# EAGLE design AIRDCR (EAGLE 9.5.1)
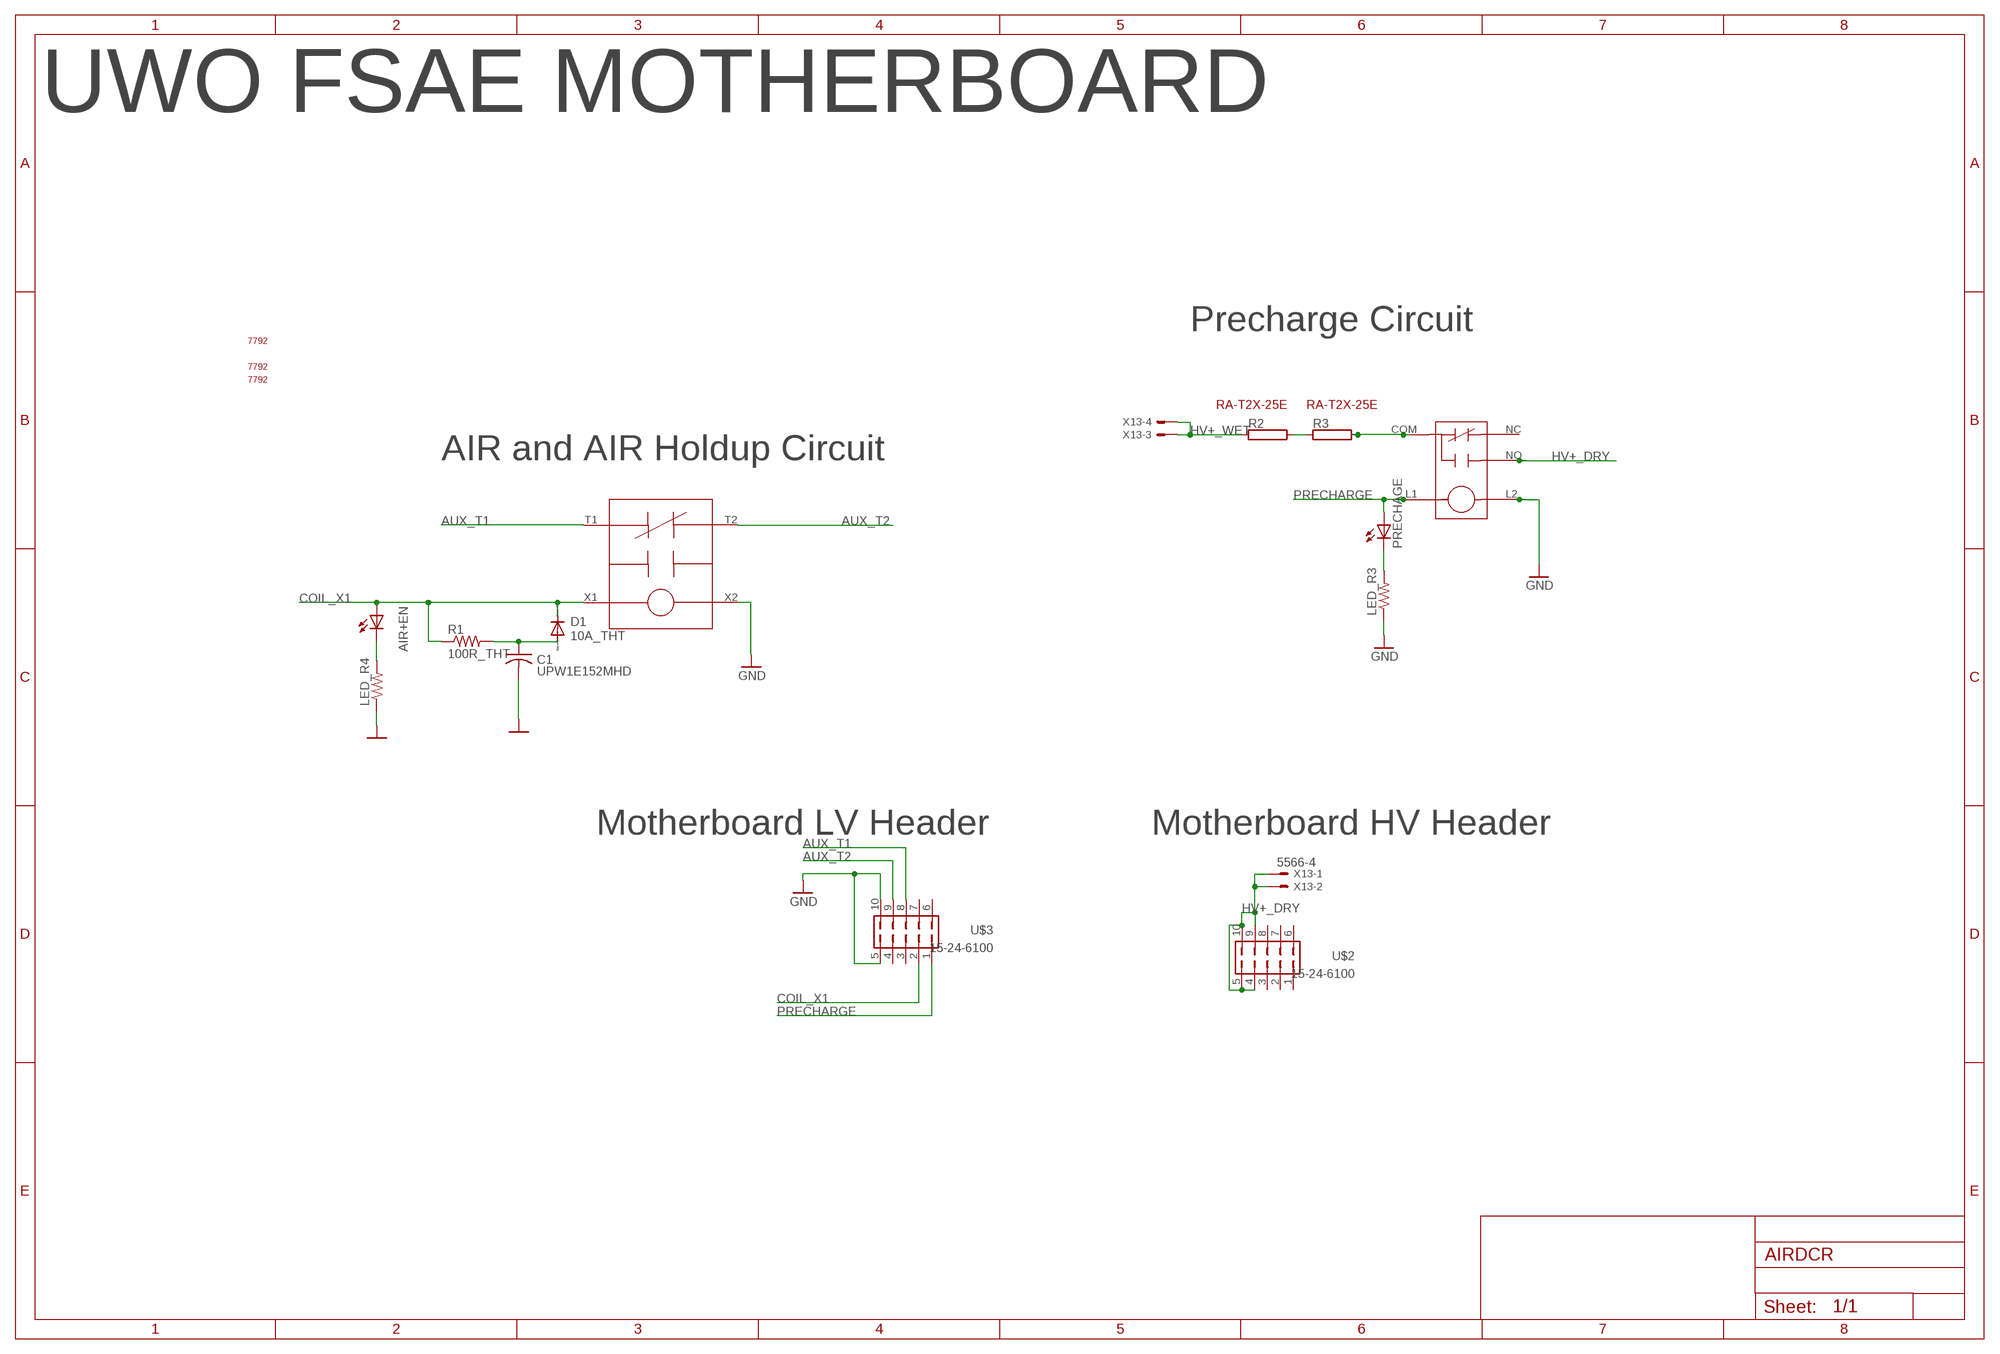
[diagram p0: schematic, sheet 1]

## Parts
AIR+EN  LEDCHIPLED_0805  [CHIPLED_0805]
C1  UPW1E152MHD  AIR_HOLDUP_CAP  [CAPPRD750W65D1800H3700B]
D1  10A_THT  AIR_HOLDUP_DIODE  [DIOAD1570W120L850D500B]
LED_R3  R-US_R0805  [R0805]
LED_R4  R-US_R0805  [R0805]
PRECHAGE  LEDCHIPLED_0805  [CHIPLED_0805]
R1  100R_THT  AIR_HOLDUP_RESISTOR  [RESAD976W63L650D250B]
R2  RMG100-V  [TO-247-2V]
R3  RMG100-V  [TO-247-2V]
U$1  GV245BPB  GV224  [GV224]
U$2  15-24-6100  [15-24-6100]
U$3  15-24-6100  [15-24-6100]
U$4  G81C335  [G81C335]
U$5  7792  [7792]
U$6  7792  [7792]
U$7  7792  [7792]
U$8  RA-T2X-25E  [RA-T2X-25E]
U$9  RA-T2X-25E  [RA-T2X-25E]
X13  5566-4  [5566-4]

## Nets
AUX_T1: U$1.T1 U$3.8
AUX_T2: U$1.T2 U$3.9
COIL_X1: AIR+EN.A D1.1(C) R1.1 U$1.X1 U$3.2
GND: C1.2 LED_R3.1 LED_R4.1 U$1.X2 U$3.5 U$3.10 U$4.L2
HV+_DRY [HV]: U$2.4 U$2.5 U$2.9 U$2.10 U$4.NO X13.1 X13.2
HV+_WET [HV]: R2.1 X13.3 X13.4
N$2: LED_R3.2 PRECHAGE.C
N$3: C1.1 D1.2(A) R1.2
N$4: R2.2 R3.1
N$5: AIR+EN.C LED_R4.2
N$21 [HV]: R3.2 U$4.COM
PRECHARGE: PRECHAGE.A U$3.1 U$4.L1
Unconnected: U$2.1 U$2.2 U$2.3 U$2.6 U$2.7 U$2.8 U$3.3 U$3.4 U$3.6 U$3.7 U$4.NC

## Notes on the sheet
- UWO FSAE MOTHERBOARD
- Precharge Circuit
- AIR and AIR Holdup Circuit
- Motherboard LV Header | Motherboard HV Header

## Library data of the parts
AIR+EN PRECHAGE = ACC-MB-R0:LED: LED OSRAM: - CHIPLED LG R971, LG N971, LY N971, LG Q971, LY Q971, LO R971, LY R971 LH N974, LH R974 LS Q976, LO Q976, LY Q976 LO Q996 - Hyper CHIPLED LW Q18S LB Q993, LB Q99A, LB R99A - SideLED LS A670, LO A670, LY A670, LG A670, LP A670 LB A673, LV A673, LT A673, LW A673 LH A674 LY A675 LS A676, LA A676, LO A676, LY A676, LW A676 LS A679, LY A679, LG A679 - Hyper Micro SIDELED® LS Y876, LA Y876, LO Y876, LY Y876 LT Y87S - SmartLED LW L88C, LW L88S LB L89C, LB L89S, LG L890 LS L89K, LO L89K, LY L89K LS L896, LA L896, LO L896, LY L896 - TOPLED LS T670, LO T670, LY T670, LG T670, LP T670 LSG T670, LSP T670, LSY T670, LOP T670, LYG T670 LG T671, LOG T671, LSG T671 LB T673, LV T673, LT T673, LW T673 LH T674 LS T676, LA T676, LO T676, LY T676, LB T676, LH T676, LSB T676, LW T676 LB T67C, LV T67C, LT T67C, LS T67K, LO T67K, LY T67K, LW E67C LS E67B, LA E67B, LO E67B, LY E67B, LB E67C, LV E67C, LT E67C LW T67C LS T679, LY T679, LG T679 LS T770, LO T770, LY T770, LG T770, LP T770 LB T773, LV T773, LT T773, LW T773 LH T774 LS E675, LA E675, LY E675, LS T675 LS T776, LA T776, LO T776, LY T776, LB T776 LHGB T686 LT T68C, LB T68C - Hyper Mini TOPLED® LB M676 - Mini TOPLED Santana® LG M470 LS M47K, LO M47K, LY M47K Source: http://www.osram.convergy.de LUXEON: - LUMILED® LXK2-PW12-R00, LXK2-PW12-S00, LXK2-PW14-U00, LXK2-PW14-V00 LXK2-PM12-R00, LXK2-PM12-S00, LXK2-PM14-U00 LXK2-PE12-Q00, LXK2-PE12-R00, LXK2-PE12-S00, LXK2-PE14-T00, LXK2-PE14-U00 LXK2-PB12-K00, LXK2-PB12-L00, LXK2-PB12-M00, LXK2-PB14-N00, LXK2-PB14-P00, LXK2-PB14-Q00 LXK2-PR12-L00, LXK2-PR12-M00, LXK2-PR14-Q00, LXK2-PR14-R00 LXK2-PD12-Q00, LXK2-PD12-R00, LXK2-PD12-S00 LXK2-PH12-R00, LXK2-PH12-S00 LXK2-PL12-P00, LXK2-PL12-Q00, LXK2-PL12-R00 Source: www.luxeon.com KINGBRIGHT: KA-3528ASYC Source: www.kingbright.com
C1 = Main:AIR_HOLDUP_CAP
D1 = Main:AIR_HOLDUP_DIODE
LED_R3 LED_R4 = ACC-MB-R0:R-US_: RESISTOR, American symbol; SPICEPREFIX: R
R1 = Main:AIR_HOLDUP_RESISTOR
R2 R3 = ACC-MB-R0:RMG100: TO-247 Power Resistor - RMG 100 Series Source: www.token.com.tw .. power-resistor-rmg100pdf; OC_FARNELL: unknown; OC_NEWARK: unknown
U$1 = ACC-MB-R0:GV224
U$2 U$3 = ACC-MB-R0:15-24-6100
U$4 = ACC-MB-R0:G81C335
U$5-U$7 = ACC-MB-R0:7792
U$8 U$9 = ACC-MB-R0:RA-T2X-25E
X13 = ACC-MB-R0:5566-4: Mini FIT connector 4 pol Source: http://www.molex.com; MF: MOLEX; OC_FARNELL: unknown; OC_NEWARK: unknown

## Net classes
0 default: width 0.2 mm, clearance 0.2 mm
2 HV: width 1.27 mm, clearance 1.8 mm to class 0, clearance 1.8 mm to class 1, clearance 1.8 mm

## Board
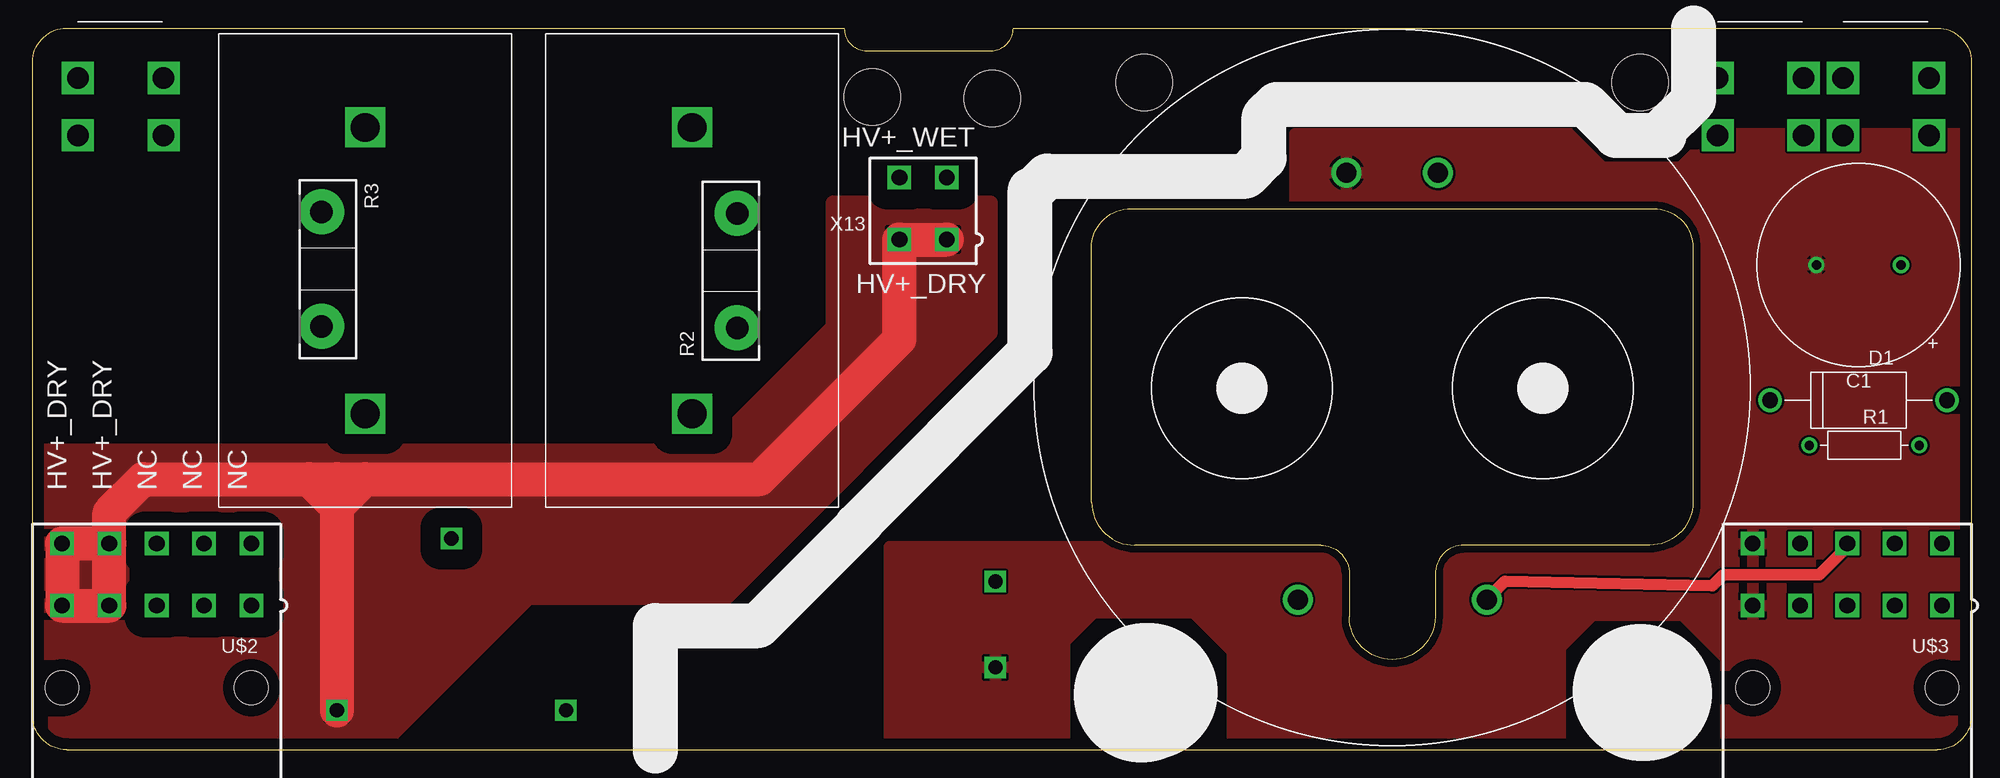
[diagram p1: board, top side]
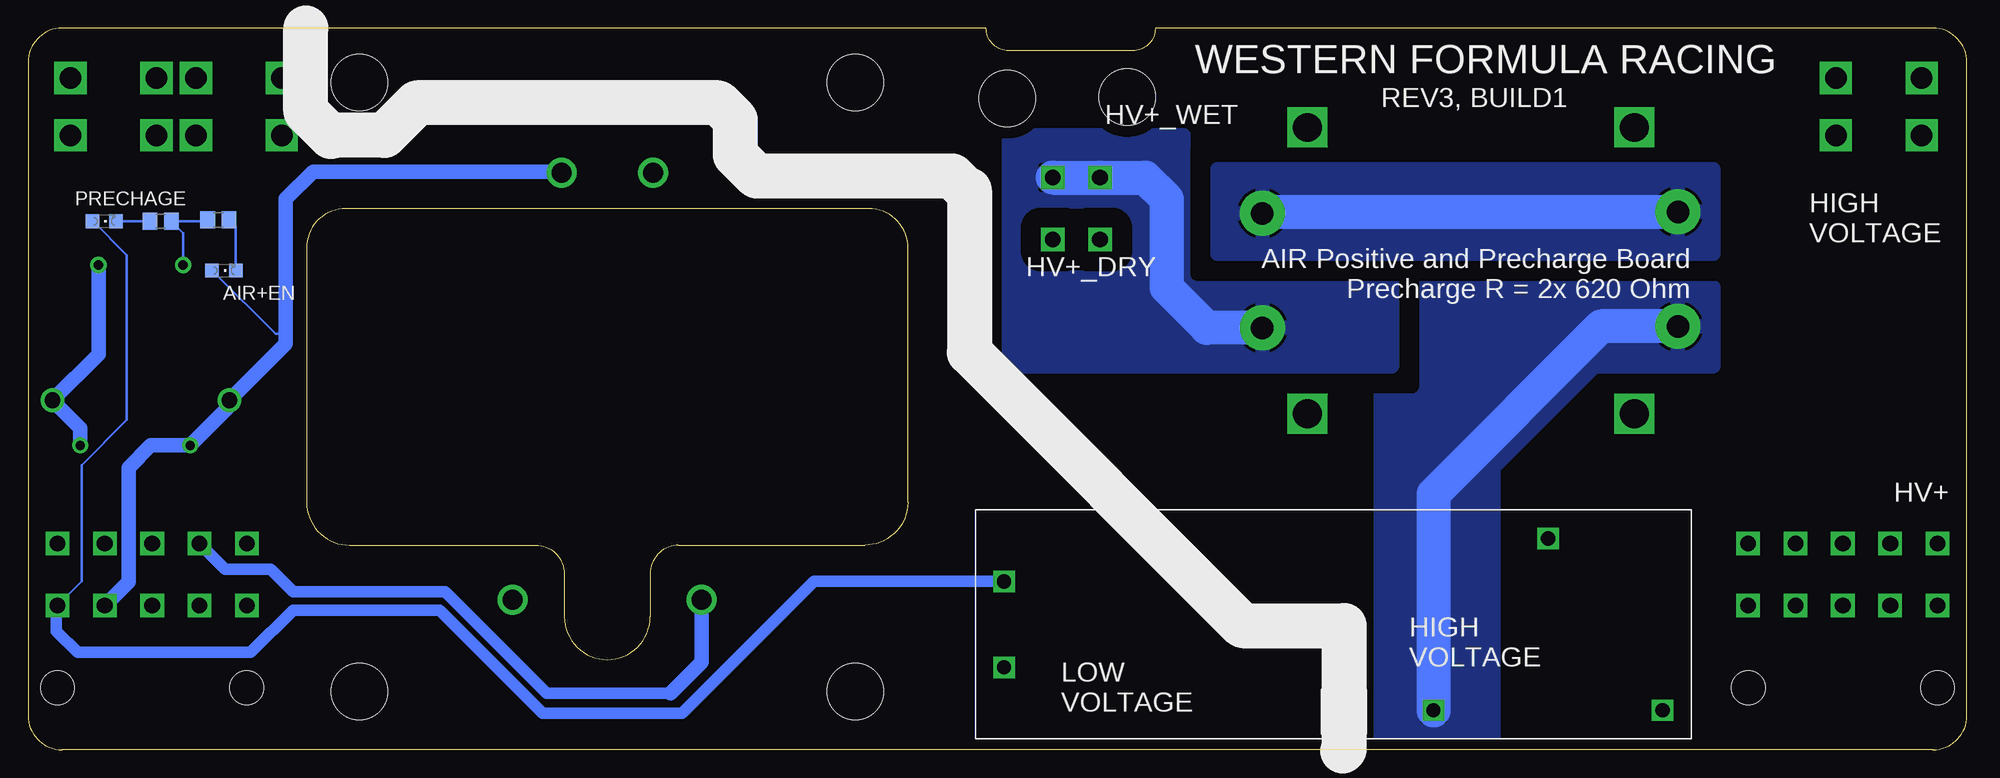
[diagram p2: board, bottom side, seen from below]

Size 172 x 64 mm. Coordinates in mm from the lower left corner, seen from the top.
Outline: 3,0 169,0 arc90 172,3 172,61 arc90 169,64 87,64 arc-90 85,62 74,62 arc-90 72,64 3,64 arc90 0,61 0,3 arc90 3,0
Copper layers (1*16): Top 0.035mm / dielectric 1.5mm / Bottom 0.035mm
Design rules "default": minimum track width 6mil, minimum drill 0.35mm, track to track 6mil, track to pad 6mil, pad to pad 6mil, via to via 6mil, smd to smd 6mil, copper to edge 40mil, drill to drill 6mil, minimum pad ring 10mil, minimum via ring 8mil, stop-mask expansion 4mil, vias tented up to drill 0mil, thermal gap 10mil
Holes 5 mm at 74.5,57.88 85.12,57.75
tRestrict: 18 lines

### Footprints (pad centres in the part's own frame; a part is rotated, then mirrored left to right if it is on the bottom)
CHIPLED_0805 = smd 1.2 x 1.2: A 0,-1.05; C 0,1.05
CAPPRD750W65D1800H3700B = drill 0.85 pad 1.45: 1 -3.75,0; 2 3.75,0
DIOAD1570W120L850D500B = drill 1.4 pad 2.1: 1 -7.85,0; 2 7.85,0
R0805 = smd 1.3 x 1.5: 1 -0.95,0; 2 0.95,0
RESAD976W63L650D250B = drill 0.83 pad 1.43: 1 -4.88,0; 2 4.88,0
TO-247-2V = drill 2 pad 4: 1 -5.08,0; 2 5.08,0
GV224 = drill 1.778: T1 -8.382,37.846; T2 8.382,37.846; X1 -4.064,0; X2 4.064,0 | hole 5: -22,46; 22,46; -22,-8; 22,-8
15-24-6100 = drill 1.4 square: 1 8.4,-2.75; 2 4.2,-2.75; 3 0,-2.75; 4 -4.2,-2.75; 5 -8.4,-2.75; 6 8.4,2.75; 7 4.2,2.75; 8 0,2.75; 9 -4.2,2.75; 10 -8.4,2.75 | hole 3: 8.4,-10.05; -8.4,-10.05
G81C335 = drill 1.27 square: COM 20.32,0; L1 58.42,-11.43; L2 58.42,-3.81; NC 10.16,-15.24; NO 0,0
7792 = drill 1.905 square: P$1 0,5.08; P$2 7.62,5.08; P$3 7.62,0; P$4 0,0
RA-T2X-25E = drill 2.54 square: P$1 -12.7,0; P$2 12.7,0
5566-4 = drill 1.4 square: 1 2.1,-2.75; 2 -2.1,-2.75; 3 2.1,2.75; 4 -2.1,2.75

### Placement (x,y rotation side)
AIR+EN  154.62,42.5 270 bottom
C1  162,43 180 top
D1  162,31 0 top
LED_R3  160.25,46.88 180 bottom
LED_R4  155.12,47 0 bottom
PRECHAGE  165.25,46.88 270 bottom
R1  162.5,27 0 top
R2  62.5,42.5 90 top
R3  25.62,42.62 270 top
U$1  120.62,51.16 180 top
U$2  11,15.54 0 top
U$3  161,15.54 0 top
U$4  27,3.5 180 bottom
U$5  4,54.5 0 top
U$6  149.5,54.5 0 top
U$7  160.62,54.5 0 top
U$8  58.5,42.5 270 top
U$9  29.5,42.5 90 top
X13  79,48 0 top

### Tracks (layer width: path | path; a pad name or v marks a point on that pad's centre or on a via)
AUX_T1
  Top 1.016: U$1.T1 130.63,14.94 149.04,14.54 150,15.5 158.5,15.5 161,18 U$3.8
AUX_T2
  Bottom 1.016: 115,5 126,5 135,14 148.5,14 150.5,16 154.51,16 U$3.9
  Bottom 1.27: 115,5 112.24,7.76 U$1.T2
COIL_X1
  Bottom 0.2: AIR+EN.A 150.05,36.88 149.15,36.88
  Bottom 1.27: U$1.X1 124.84,51.28 146.72,51.28 149.15,48.85 149.15,36.88 149.15,36 D1.1 154.15,30.47 R1.1 161.12,27 163.09,25.02 163.09,14.89 U$3.2
GND
  Bottom 0.2: C1.2 158.25,45.83 LED_R3.1 156.2,46.88 LED_R4.1
  pour Top: 76,18 76,-1.5 180,-1.5 180,54.62 112,54.62 112,18
HV+_DRY
  Top 3: U$2.9 U$2.4 U$2.5 U$2.10 U$2.9 | X13.1 X13.2 76.9,36.4 64.5,24 29.5,24 | 24.5,24 9.8,24 6.8,21 U$2.9 | 24.5,24 27,24 | 27,24 29.5,24 | U$4.NO 27,21.5 | 27,21.5 27,22 | 27,24 27,22 | 27,21.5 29.5,24 | 27,22 26.5,22 24.5,24
  pour Top: 85,48.5 71,48.5 71,37.5 60,26.5 -1.5,26.5 -1.5,-2 28.5,-2 44,13.5 61.5,13.5 85,37
HV+_WET
  Bottom 3: R2.1 67.42,37.42 71,41 71,48.85 72.9,50.75 X13.4 X13.3
  pour Bottom (rank 2): 51,34 85,34 85,54.5 69.5,54.5 69.5,42.62 51,42.62
N$2
  Bottom 0.2: LED_R3.2 PRECHAGE.C
N$3
  Bottom 1.27: R1.2 167.38,28.53 D1.2 165.75,35.1 C1.1
N$4
  Bottom 3: R2.2 62.38,47.7 R3.1
  pour Bottom: 22.5,44 66.5,44 66.5,51.5 22.5,51.5
N$5
  Bottom 0.2: AIR+EN.C 153.57,46.4 LED_R4.2
N$21
  Bottom 3: R3.2 32.45,37.55 47.32,22.68 U$4.COM
  pour Bottom (rank 3): 22.5,41 52,41 52,0 42,0 42,25 33,34 22.5,34
PRECHARGE
  Bottom 0.2: U$3.1 167.25,14.94 167.25,25.25 163.25,29.25 163.25,43.88 166.25,46.88 PRECHAGE.A
  Bottom 1: U$4.L1 102.3,14.93 113.97,3.25 126.38,3.25 | 131.75,8.62 135.5,12.38 148.5,12.38 152.25,8.62 167.62,8.62
  Bottom 1.016: 167.62,8.62 169.5,10.5 169.5,12.69 U$3.1 | 126.38,3.25 131.75,8.62

### Text on the board
tNames: HV+_WET | HV+_DRY | HV+_DRY | HV+_DRY | NC | NC | NC
bNames: WESTERN FORMULA RACING | REV3, BUILD1 | HV+_WET | HIGH / VOLTAGE | AIR Positive and Precharge Board / Precharge R = 2x 620 Ohm | HV+_DRY | HV+ | HIGH / VOLTAGE | LOW / VOLTAGE
tValues: BUILD 2